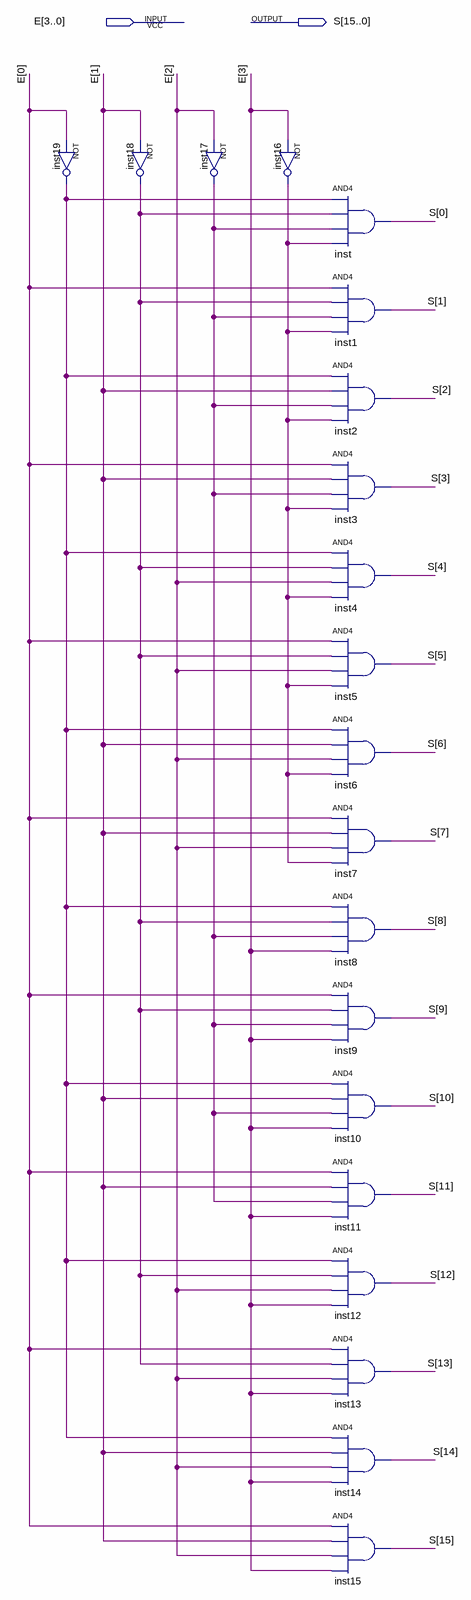
[diagram p0: schematic sheet]
// Quartus schematic DECODER_4_16.bdf as structural Verilog: 20 symbols, 2 pins
module DECODER_4_16 (
  input  [3:0] E,
  output [15:0] S
);

  wire inst16_out, inst17_out, inst18_out, inst19_out;

  not inst19 (inst19_out, E[0]);
  not inst18 (inst18_out, E[1]);
  not inst17 (inst17_out, E[2]);
  not inst16 (inst16_out, E[3]);
  and inst (S[0], inst19_out, inst18_out, inst17_out, inst16_out);
  and inst1 (S[1], E[0], inst18_out, inst17_out, inst16_out);
  and inst2 (S[2], inst19_out, E[1], inst17_out, inst16_out);
  and inst3 (S[3], E[0], E[1], inst17_out, inst16_out);
  and inst4 (S[4], inst19_out, inst18_out, E[2], inst16_out);
  and inst5 (S[5], E[0], inst18_out, E[2], inst16_out);
  and inst6 (S[6], inst19_out, E[1], E[2], inst16_out);
  and inst7 (S[7], E[0], E[1], E[2], inst16_out);
  and inst8 (S[8], inst19_out, inst18_out, inst17_out, E[3]);
  and inst9 (S[9], E[0], inst18_out, inst17_out, E[3]);
  and inst10 (S[10], inst19_out, E[1], inst17_out, E[3]);
  and inst11 (S[11], E[0], E[1], inst17_out, E[3]);
  and inst12 (S[12], inst19_out, inst18_out, E[2], E[3]);
  and inst13 (S[13], E[0], inst18_out, E[2], E[3]);
  and inst14 (S[14], inst19_out, E[1], E[2], E[3]);
  and inst15 (S[15], E[0], E[1], E[2], E[3]);
endmodule
